# Altium schematic sheet Comparator.SchDoc: Наименование
size 420 x 297 mm; ApprovedBy: Утвердил; CheckedBy: Проверил; Author: Разработал; CompanyName: Организация; DrawnBy: Н.Контр; Engineer: Т.Контр; SheetNumber: 1; SheetTotal: 1; PageSetup: Record=PageOptions|CenterHorizontal=True|CenterVertical=True|PrintScale=0.94|XCorrection=1.00|YCorrection=1.00|PrintKind=1|BorderSize=5000000|LeftOffset=0|BottomOffset=0|Orientation=1|PaperLength=1000|PaperWidth=1000|Scale=100|PaperSource=7|PrintQuality=-4|MediaType=1|DitherType=10|PaperKind=A4|PrintScaleMode=1; DecimalNumber: Comparator; HeadOfSector: Нач. сектора; MainDevice: Перв.примен.; Name: Наименование; DocumentName: Sheet1.SCHDOC
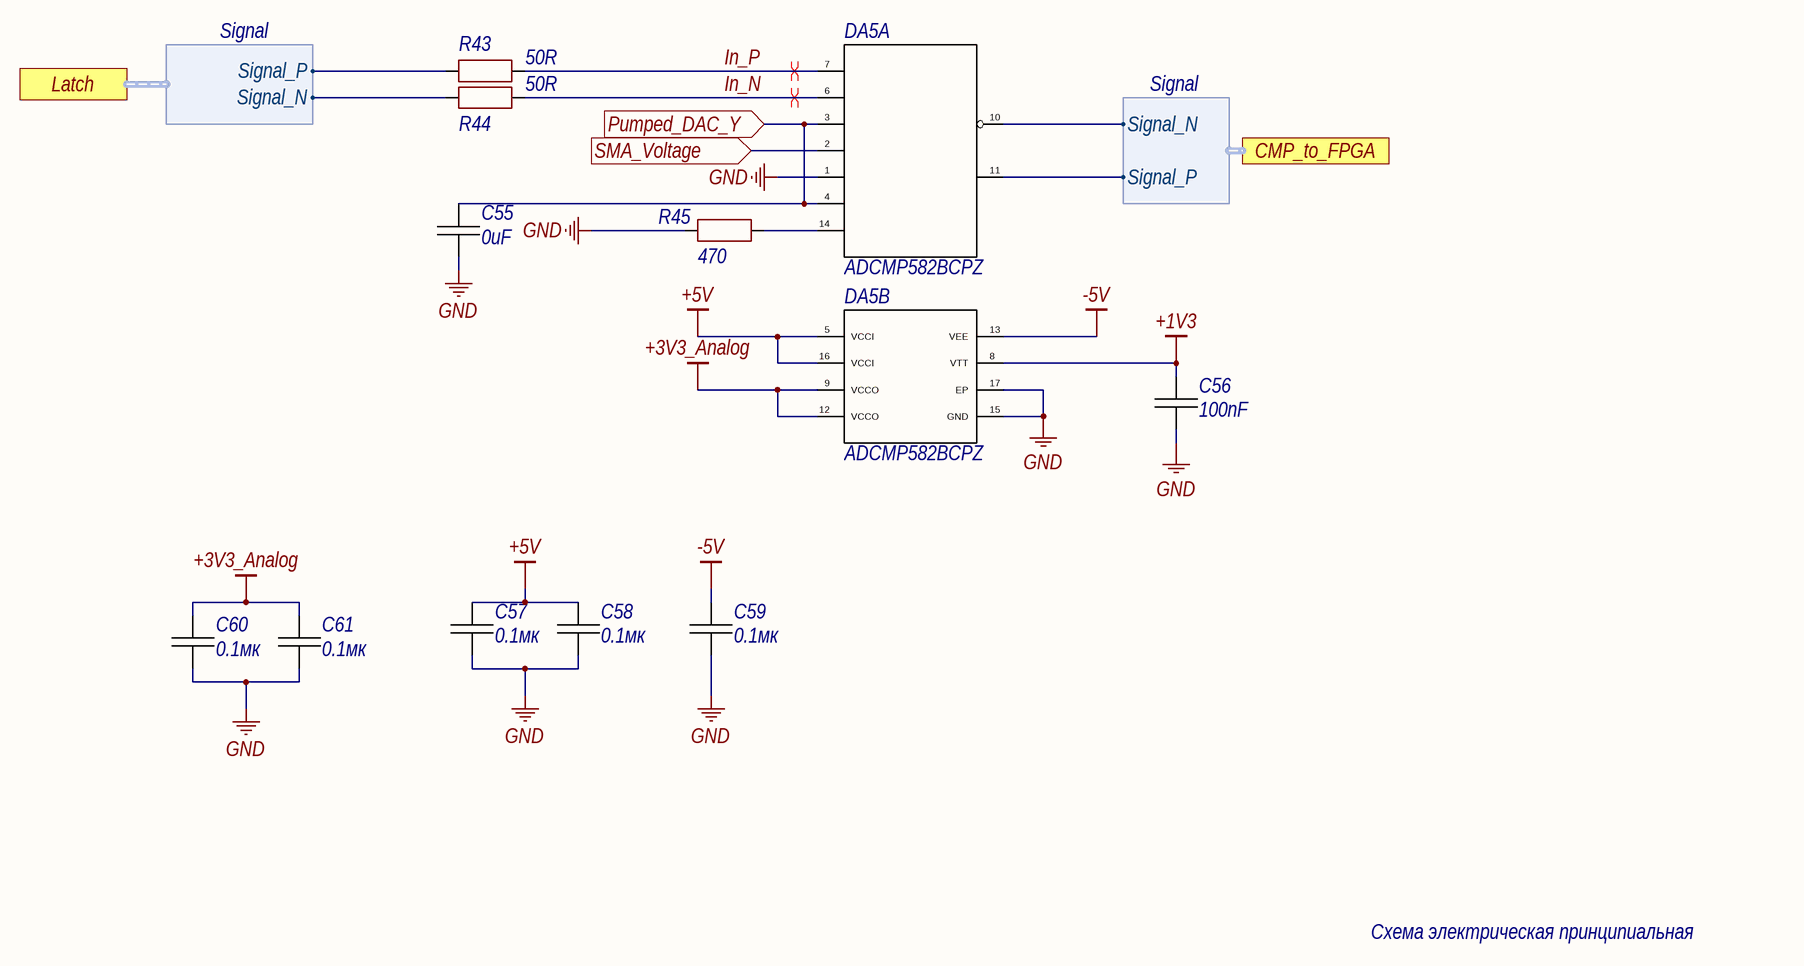
[diagram p0: Comparator.SchDoc]

## Parts
C55  value 0uF  [CAP0402]  (hidden comment: 0uF 50V)
C56  value 100nF  [CAP0402]  (hidden comment: 100nF 50V)
C57  value 0.1мк  [CAP0402]  (hidden comment: 0.1мк 50V)
C58  value 0.1мк  [CAP0402]  (hidden comment: 0.1мк 50V)
C59  value 0.1мк  [CAP0402]  (hidden comment: 0.1мк 50V)
C60  value 0.1мк  [CAP0402]  (hidden comment: 0.1мк 50V)
C61  value 0.1мк  [CAP0402]  (hidden comment: 0.1мк 50V)
DA5  (no value)  [ADI-CP-16-3_N]  (parts A,B of 2)
R43  50R  [RESC0402(1005)_M]
R44  50R  [RESC0402(1005)_M]
R45  470  [RESC0402(1005)_M]

## Ports
CMP_to_FPGA (harness Signal), Latch (harness Signal), Pumped_DAC_Y (in), SMA_Voltage (in)

## Harnesses
Signal: Signal_N, Signal_P

## Nets
+1V3: C56.2 DA5.8(VTT)
+3V3_Analog: C60.1 C61.1 DA5.9(VCCO) DA5.12(VCCO)
+5V: C57.1 C58.1 DA5.5(VCCI) DA5.16(VCCI)
-5V: C59.1 DA5.13(VEE)
GND: C55.2 C56.1 C57.2 C58.2 C59.2 C60.2 C61.2 DA5.1(VTP) DA5.15(GND) DA5.17(EP) R45.1
In_N: DA5.6(~{LE}) R44.1
In_P: DA5.7(LE) R43.1
Pumped_DAC_Y: C55.1 DA5.3(VN) DA5.4(VTN) ; port Pumped_DAC_Y
SMA_Voltage: DA5.2(VP) ; port SMA_Voltage
NetDA5_10: DA5.10(~{Q}) ; port CMP_to_FPGA.Signal_N
NetDA5_11: DA5.11(Q) ; port CMP_to_FPGA.Signal_P
NetDA5_14: DA5.14(HYS) R45.2
NetR43_2: R43.2 ; port Latch.Signal_P
NetR44_2: R44.2 ; port Latch.Signal_N

## Layout directives
differential pair; differential pair class LVDS/PECL: In_N, In_P

## Notes on the sheet
- Схема электрическая принципиальная
- Подп. и дата
- Инв.№ дубл.
- Взам.инв.№
- Подп.и дата
- Инв.№ подл.
- Изм.
- Лист
- № докум.
- Подп.
- Дата
- Формат  A3

## Library data of the parts
C55-C61 = CAP0402: Manufacturer: Samsung Electro-Mechanics; ManufacturerAlt: JLCPCB; MPN: CL05B104KB54PNC; MPNAlt: C307331; MntType: SMD; Notes: Basic Part; Tolerance: 10%; Height: 0.5mm; MSL: MSL 1; Package: =Footprint; RoHS: Comply; Weight: 1.500mg; PartType: CHIP CERAMIC CAPACITOR; Pins: 2; BOMDescription: =MntType+' '+PartType+' '+Package+' '+Value+' '+Tolerance+' '+Voltage+' '+TempCoeff+' '+MPN; CFootprint: =Footprint; Voltage: 50V; Part Number: CAP0402; ClassName: Capacitor; ComponentLink1Description: Datasheet; ComponentLink1Description: New link; ComponentLink1URL: https://datasheet.lcsc.com/lcsc/1810191222_Samsung-Electro-Mechanics-CL05B104KB54PNC_C307331.pdf
DA5 = ADCMP582BCPZ: Ultrafast SiGe Voltage Comparator, + / - 5 V, 180 ps Delay, Industrial, 16-pin QFN (CP-16-3), Reel; MANUFACTURER: AD; MNTTYPE: SMD; MPN: ADCMP582BCPZ; PART NUMBER: ADCMP582BCPZ; MSL: MSL 1; PACKAGE: LFCSP-16; ROHS: Comply; PARTTYPE: Comparator; PINS: 16; BOMDESCRIPTION: =MntType+' '+PartType+' '+Package+' '+Value+' '+Tolerance+' '+Voltage+' '+TempCoeff+' '+MPN; CFOOTPRINT: =Footprint; CLASSNAME: Comparator; COMPONENTLINK1DESCRIPTION: Datasheet; COMPONENTLINK1URL: https://www.analog.com/media/en/technical-documentation/data-sheets/ADCMP580_581_582.pdf
R43 R44 = RES0402: MntType: SMD; MSL: MSL 1; Package: =Footprint; RoHS: Comply; PartType: CHIP RESISTOR; Pins: 2; BOMDescription: =MntType+' '+PartType+' '+Package+' '+Value+' '+Tolerance+' '+Voltage+' '+TempCoeff+' '+MPN; CFootprint: =Footprint; Value: 50R; Part Number: RES0402; ClassName: Resistor; ComponentLink1Description: Datasheet
R45 = RES0402: Manufacturer: UNI-ROYAL(Uniroyal Elec); ManufacturerAlt: JLCPCB; MPN: 0402WGF4700TCE; MPNAlt: C25117; MntType: SMD; Tolerance: 1%; MSL: MSL 1; Package: =Footprint; RoHS: Comply; PartType: CHIP RESISTOR; Pins: 2; BOMDescription: =MntType+' '+PartType+' '+Package+' '+Value+' '+Tolerance+' '+Voltage+' '+TempCoeff+' '+MPN; CFootprint: =Footprint; Value: 470; Part Number: RES0402; ClassName: Resistor; ComponentLink1Description: Datasheet